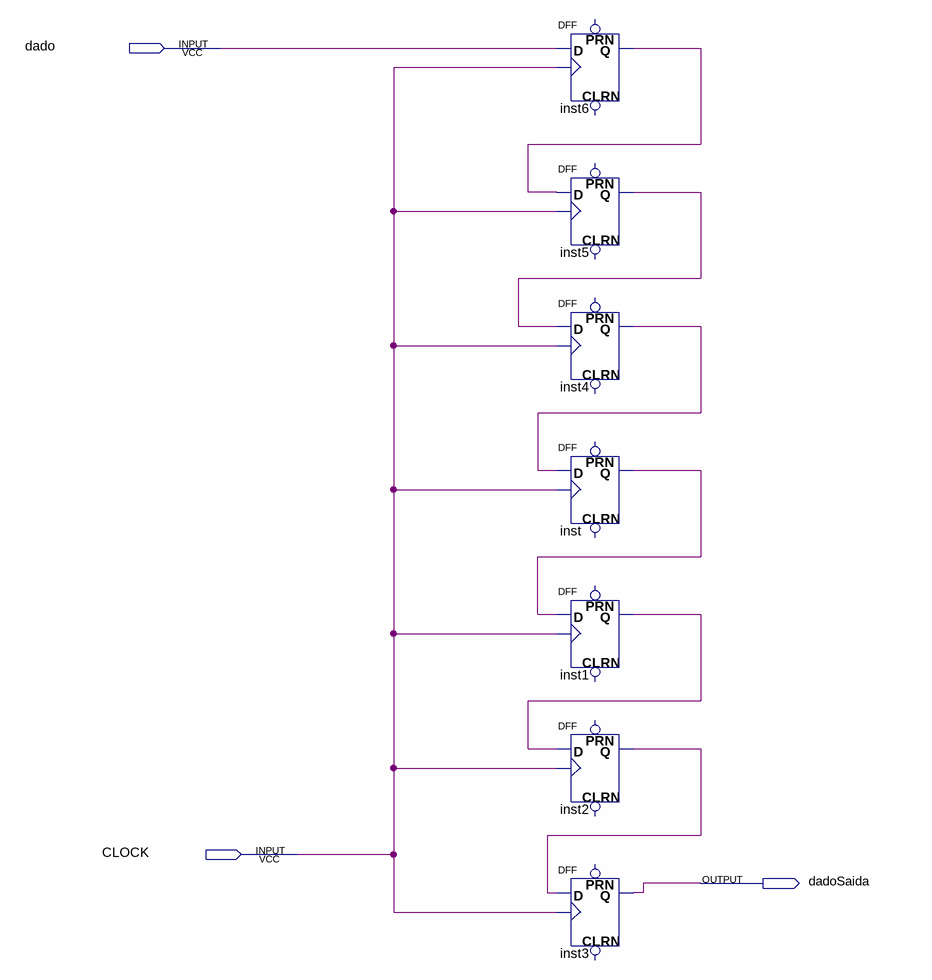
[diagram p0: schematic sheet]
// Quartus schematic memoriaReg.bdf as structural Verilog: 7 symbols, 3 pins
module memoriaReg (
  input  dado,
  input  CLOCK,
  output dadoSaida
);

  wire inst1_q, inst2_q, inst4_q, inst5_q, inst6_q, inst_q;

  DFF inst6 (.CLK(CLOCK), .D(dado), .Q(inst6_q));  // open: CLRN, PRN
  DFF inst5 (.CLK(CLOCK), .D(inst6_q), .Q(inst5_q));  // open: CLRN, PRN
  DFF inst4 (.CLK(CLOCK), .D(inst5_q), .Q(inst4_q));  // open: CLRN, PRN
  DFF inst (.CLK(CLOCK), .D(inst4_q), .Q(inst_q));  // open: CLRN, PRN
  DFF inst1 (.CLK(CLOCK), .D(inst_q), .Q(inst1_q));  // open: CLRN, PRN
  DFF inst2 (.CLK(CLOCK), .D(inst1_q), .Q(inst2_q));  // open: CLRN, PRN
  DFF inst3 (.CLK(CLOCK), .D(inst2_q), .Q(dadoSaida));  // open: CLRN, PRN
endmodule
